# Altium schematic sheet trackmove-schem.schdoc
size 431 x 279 mm; Symbol: Drawing-Symbol_A4; Device: Drawing-Symbol_A4; @Project Name: CUSTOM LFR; @Page Count: 1; @Update Date: 2025-06-18; @Create Date: 2025-06-18; @Schematic Name: Schematic1; @Page No: 1; @Page Name: P1; Company: EasyEDA.com; Version: V1.0; Page Size: A4; @Create Time: 17:21:24; @Update Time: 18:08:14; Width: 1170; Height: 825; Region Start: 1; X Region Count: 6; Y Region Count: 4; Blade Width: 10; Title Block Position: 3; @Board Name: Board1; SheetNumber: 1; SheetTotal: 1
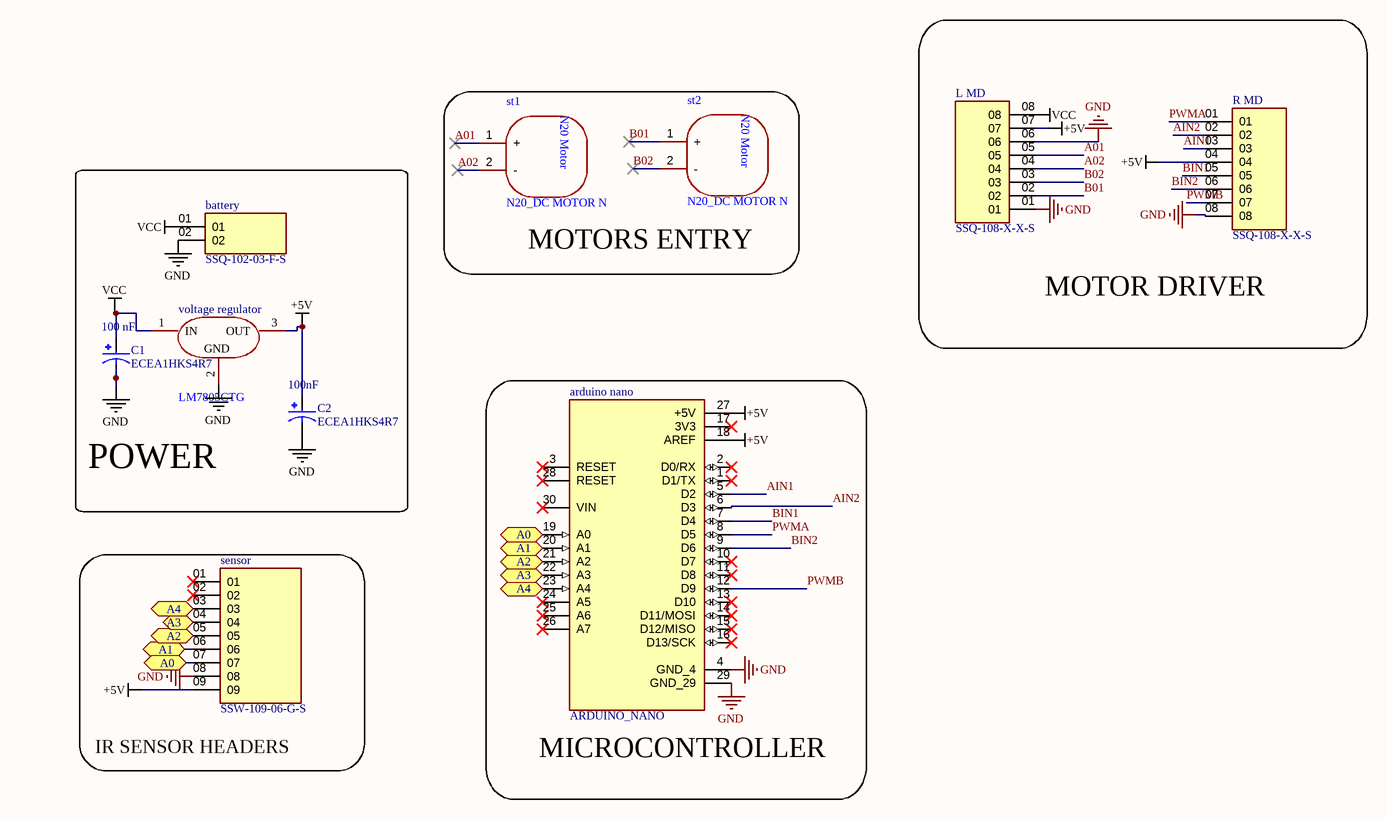
[diagram p0: trackmove-schem.schdoc]

## Parts
arduino_nano  ARDUINO_NANO  [MODULE_ARDUINO_NANO]
battery  SSQ-102-03-F-S  [new-SAMTEC_SSQ-102-03-F-S]
C1  ECEA1HKS4R7  value 100 nF  [new-CAPPRD200W45D500H500]
C2  ECEA1HKS4R7  value 100nF  [new-CAPPRD200W45D500H500]
L_MD  SSQ-108-X-X-S  [SAMTEC_SSQ-108-X-X-S]
R_MD  SSQ-108-X-X-S  [SAMTEC_SSQ-108-X-X-S]
sensor  SSW-109-06-G-S  [SAMTEC_SSW-109-06-G-S-new]
st1  N20_DC MOTOR N  [HANDSON_KF301-2P]
st2  N20_DC MOTOR N  [HANDSON_KF301-2P]
voltage_regulator  LM7805CTG  [TO254P1054X470X1955-3]

## Blocks framed on the sheet
MOTOR DRIVER: L_MD R_MD
MOTORS ENTRY: st1 st2
POWER: battery C1 C2 voltage_regulator
MICROCONTROLLER: arduino_nano
IR SENSOR HEADERS: sensor

## Ports
A0 (bidir), A1 (bidir), A2 (bidir), A3 (bidir), A4 (bidir)

## Nets
+5V: arduino_nano.18(AREF) arduino_nano.27(+5V) C2.P L_MD.07 R_MD.04 sensor.09 voltage_regulator.3(OUT)
GND: arduino_nano.4(GND_4) arduino_nano.29(GND_29) battery.02 C1.N C2.N L_MD.01 L_MD.06 R_MD.08 sensor.08 voltage_regulator.2(GND)
VCC: battery.01 C1.P L_MD.08 voltage_regulator.1(IN)
A0: arduino_nano.19(A0) sensor.07 ; port A0
A01: L_MD.05 st1.1(+)
A1: arduino_nano.20(A1) sensor.06 ; port A1
A02: L_MD.04 st1.2(-)
A2: arduino_nano.21(A2) sensor.05 ; port A2
A3: arduino_nano.22(A3) sensor.04 ; port A3
A4: arduino_nano.23(A4) sensor.03 ; port A4
AIN1: arduino_nano.5(D2) R_MD.03
AIN2: arduino_nano.6(D3) R_MD.02
B01: L_MD.02 st2.1(+)
B02: L_MD.03 st2.2(-)
BIN1: arduino_nano.7(D4) R_MD.05
BIN2: arduino_nano.9(D6) R_MD.06
PWMA: arduino_nano.8(D5) R_MD.01
PWMB: arduino_nano.12(D9) R_MD.07

Not connected (* = marked no-connect by the designer): arduino_nano 1(D1/TX)* 2(D0/RX)* 3(RESET)* 10(D7)* 11(D8)* 13(D10)* 14(D11/MOSI)* 15(D12/MISO)* 16(D13/SCK)* 17(3V3)* 24(A5)* 25(A6)* 26(A7)* 28(RESET)* 30(VIN)*; sensor 01* 02*

## Notes on the sheet
- (in symbol N20_DC MOTOR N) N20 Motor

## Library data of the parts
arduino_nano = ARDUINO_NANO: Small, complete, and breadboard-friendly board based on the ATmega328 (Arduino Nano 3.x); SnapEDA_Link: https://www.snapeda.com/parts/Arduino%20Nano/Arduino/view-part/?ref=snap; Package: Non-Standard Arduino; Value: *; MF: Arduino; MP: Arduino Nano; Check_prices: https://www.snapeda.com/parts/Arduino%20Nano/Arduino/view-part/?ref=eda
battery = SSQ-102-03-F-S: Conn Socket Strip SKT 2 POS 2.54mm Solder ST Top Entry Thru-Hole Bulk; MF: Samtec; SnapEDA_Link: https://www.snapeda.com/parts/SSQ-102-03-F-S/Samtec/view-part/?ref=snap; Package: None; Value: *; MP: SSQ-102-03-F-S; Check_prices: https://www.snapeda.com/parts/SSQ-102-03-F-S/Samtec/view-part/?ref=eda
C1 C2 = ECEA1HKS4R7: Capacitor; Aluminum Electrolytic; Cap 4.7uF; Vol-Rtg 50V; Radial; Ks; Height 5mm; MF: Panasonic; MP: ECE-A1HKS4R7; Availability: In Stock; Check_prices: https://www.snapeda.com/parts/ECE-A1HKS4R7/Panasonic/view-part/2302906/?ref=eda; Package: RADIAL-2 Panasonic; Price: None; SnapEDA_Link: https://www.snapeda.com/parts/ECE-A1HKS4R7/Panasonic/view-part/2302906/?ref=snap
L_MD R_MD = SSQ-108-X-X-S: 8 Position Receptacle Connector Through Hole, Right Angle; MF: Samtec Inc.; Value: *; MP: SSQ-108-X-X-S; Package: None; Price: None; Availability: Unavailable
sensor = SSW-109-06-G-S: MF: Samtec; MP: SSW-109-06-G-S; Value: *; Package: None; Price: None; Availability: Unavailable
st1 st2 = N20_DC MOTOR N: Add into BOM: yes; 3DModel: N20 Motor and Wheel; Symbol: N20_DC MOTOR N; Device: N20_DC MOTOR N; Convert to PCB: yes
voltage_regulator = LM7805CTG: Manufacturer: HGC(深圳汉芯); Add into BOM: yes; Output Type: Fixed; Voltage - Supply: 35V; Output Voltage: 5V; Output Current: 1A; Power Supply Rejection Ratio (PSRR): 73dB@(120Hz); Output Configuration: Positive electrode; Number of Outputs: 1; Symbol: LM7805CTG; Device: LM7805CTG; LCSC Part Name: 三端1A正电源稳压电路; Supplier Part: C2977083; Manufacturer Part: LM7805CTG; Supplier Footprint: TO-220; JLCPCB Part Class: Extended Part; Datasheet: https://atta.szlcsc.com/upload/public/pdf/source/20220425/1AD29514C6CC449CC18E73451741492B.pdf; Supplier: LCSC; Convert to PCB: yes; Operating Temperature: 0℃~+85℃